# Altium project CTEN_LEDDRVR.PrjPcb
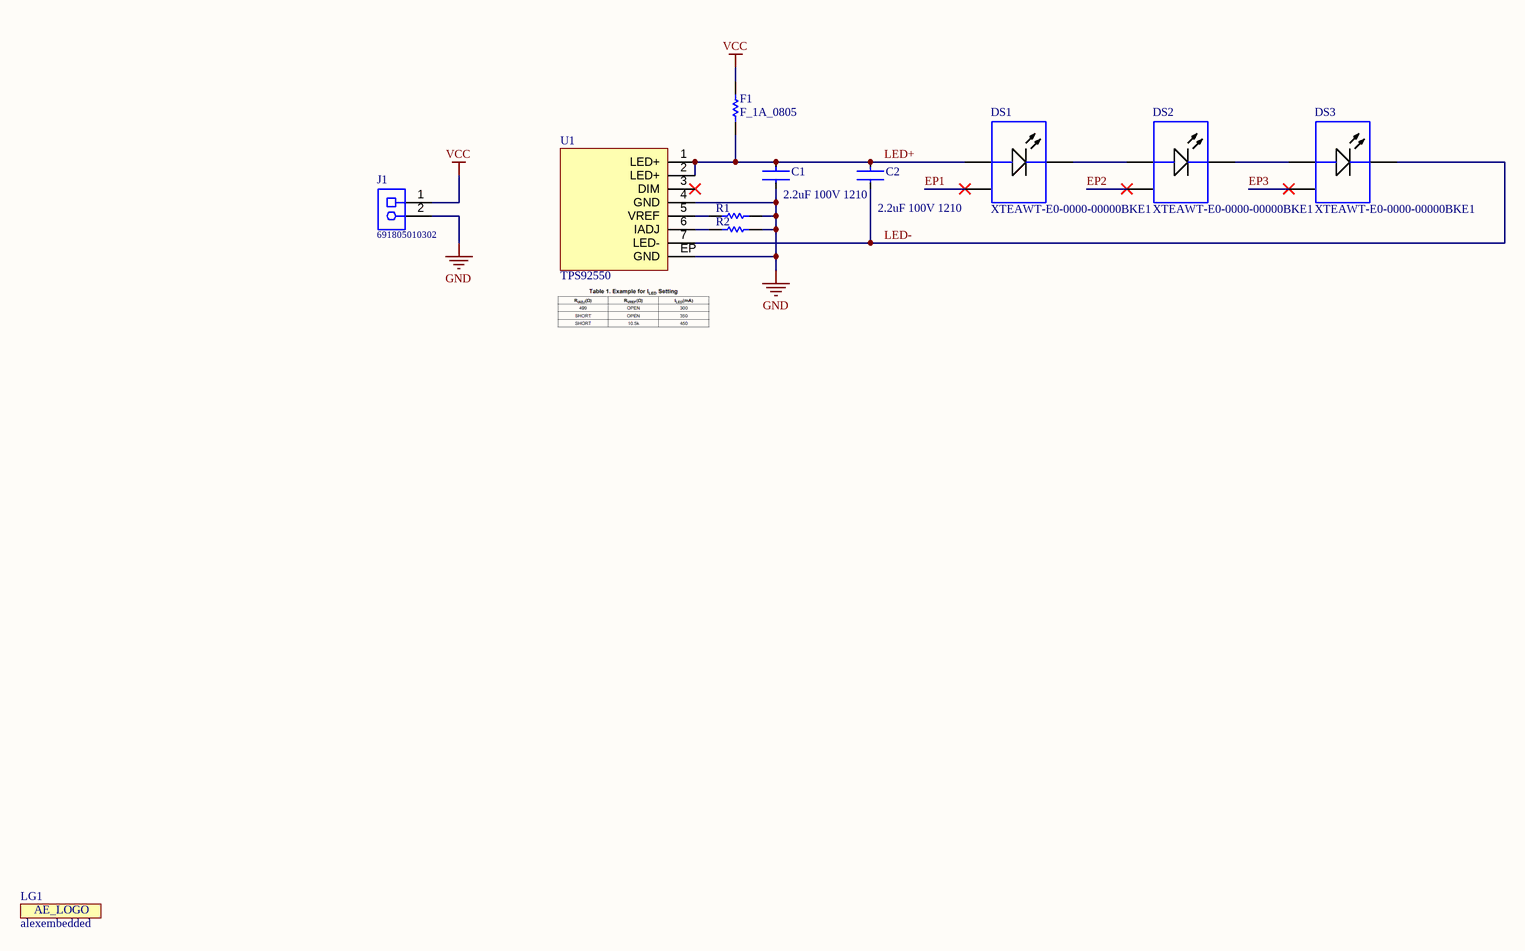
[diagram p0: CTENLEDDRVR.SchDoc]
Githash: =VersionControl_ProjFolderRevNumber
1 sheet, 11 parts. Net scope: global (net labels, ports and power ports of the same name join across sheets).
Board file: CTENLEDDRVR.PcbDoc

## Sheet CTENLEDDRVR.SchDoc: CTENLEDDRVR
size 431 x 279 mm; Date: 7/13/22; Engineer: Alexander Rivera; Organization: alexembedded; SheetNumber: 1; SheetTotal: 1

### Parts
C1  2.2uF 100V 1210  [FP-CL32-IPC_C]
C2  2.2uF 100V 1210  [FP-CL32-IPC_C]
DS1  XTEAWT-E0-0000-00000BKE1  [CREE-XTE-2_V]
DS2  XTEAWT-E0-0000-00000BKE1  [CREE-XTE-2_V]
DS3  XTEAWT-E0-0000-00000BKE1  [CREE-XTE-2_V]
F1  F_1A_0805  [RESC2013X50X30NL20T20]
J1  691805010302  [691805010302]
LG1  alexembedded  [alexembedded-Footprint-1]  (no BOM)
R1  R_0R_0603  [RESC1609X50X30LL8T20]  (value not drawn)
R2  R_0R_0603  [RESC1609X50X30LL8T20]  (value not drawn)
U1  TPS92550  [TPS92550-Footprint-1]

### Nets
GND: C1.2 J1.2 R1.2 R2.2 U1.4(GND) U1.EP(GND)
VCC: F1.2 J1.1
EP1: DS1.2(EP)
EP2: DS2.2(EP)
EP3: DS3.2(EP)
LED+: C1.1 C2.1 DS1.1(A) F1.1 U1.1(LED+) U1.2(LED+)
LED-: C2.2 DS3.3(K) U1.7(LED-)
NetDS1_3: DS1.3(K) DS2.1(A)
NetDS2_3: DS2.3(K) DS3.1(A)
NetR1_1: R1.1 U1.5(VREF)
NetR2_1: R2.1 U1.6(IADJ)

Not connected (* = marked no-connect by the designer): U1 3(DIM)*

### Notes on the sheet
- Title:
- Organization:
- Date:
- File:
- Sheet:
- Engineer:
- of
- Revision:
- (in symbol CMP-2539-3) AE_LOGO

### Library data of the parts
C1 C2 = CMP-000022-1: Ceramic capacitor SMD-1210 2200nF (2.2uF) /100V X7R# K +- 10% Samsung, RoHS/2k/; Dielectric: X7R; Width: 0.098inch; Packaging: Tape and Reel; Case Code (Imperial): 1210; Voltage Rating: 100V; Max Operating Temperature: 125°C; Package Quantity: 1; RoHS Compliant: Yes; Case/Package: 1210; Voltage: 100V; Min Operating Temperature: -55°C; Length: 3.2mm; Thickness: 0.106inch; Depth: 2.5mm; Series: CL; Capacitance: 2.2uF; Case Code (Metric): 3225; Construction: Flat; Radiation Hardening: No; Height: 2.5mm; Contact Plating: Tin; Tolerance: 10%; Mount: Surface Mount
DS1-DS3 = CMP-007-00000-1: LED Uni-Color Cool White 6500K 70 2-Pin SMD EP T/R
F1 = CMP-005-00000-1: Fuse, 1A, 0805
J1 = CMP-1502-02888-1: Serie 8050 - 2.50mm Screwless SMT - WR-TBL, 2 pin; Manufacturer: Wurth Elektronik; Pin Number: 2; Manufacturer URL: http://www.we-online.de; Datasheet URL: http://katalog.we-online.de/em/datasheet/691805010302.pdf; Packaging: TapeandReel; Publisher: WurthElektronik; Mounting Technology: SMT; Pitch: 2.50mm; Part Number: 691805010302; Package Reference: 691805010302; Operating Temperature: -45to130degC
LG1 = CMP-2539-3: alexembedded graphic
R1 R2 = CMP-009-00062-1: Res, 0 Ohm, 0603
U1 = CMP-019-00007-3: LED Driver IC 1 Output DC DC Regulator Step-Down (Buck) PWM Dimming 450mA TO-PMOD-7